# EAGLE design V1b (EAGLE 6.5.0)
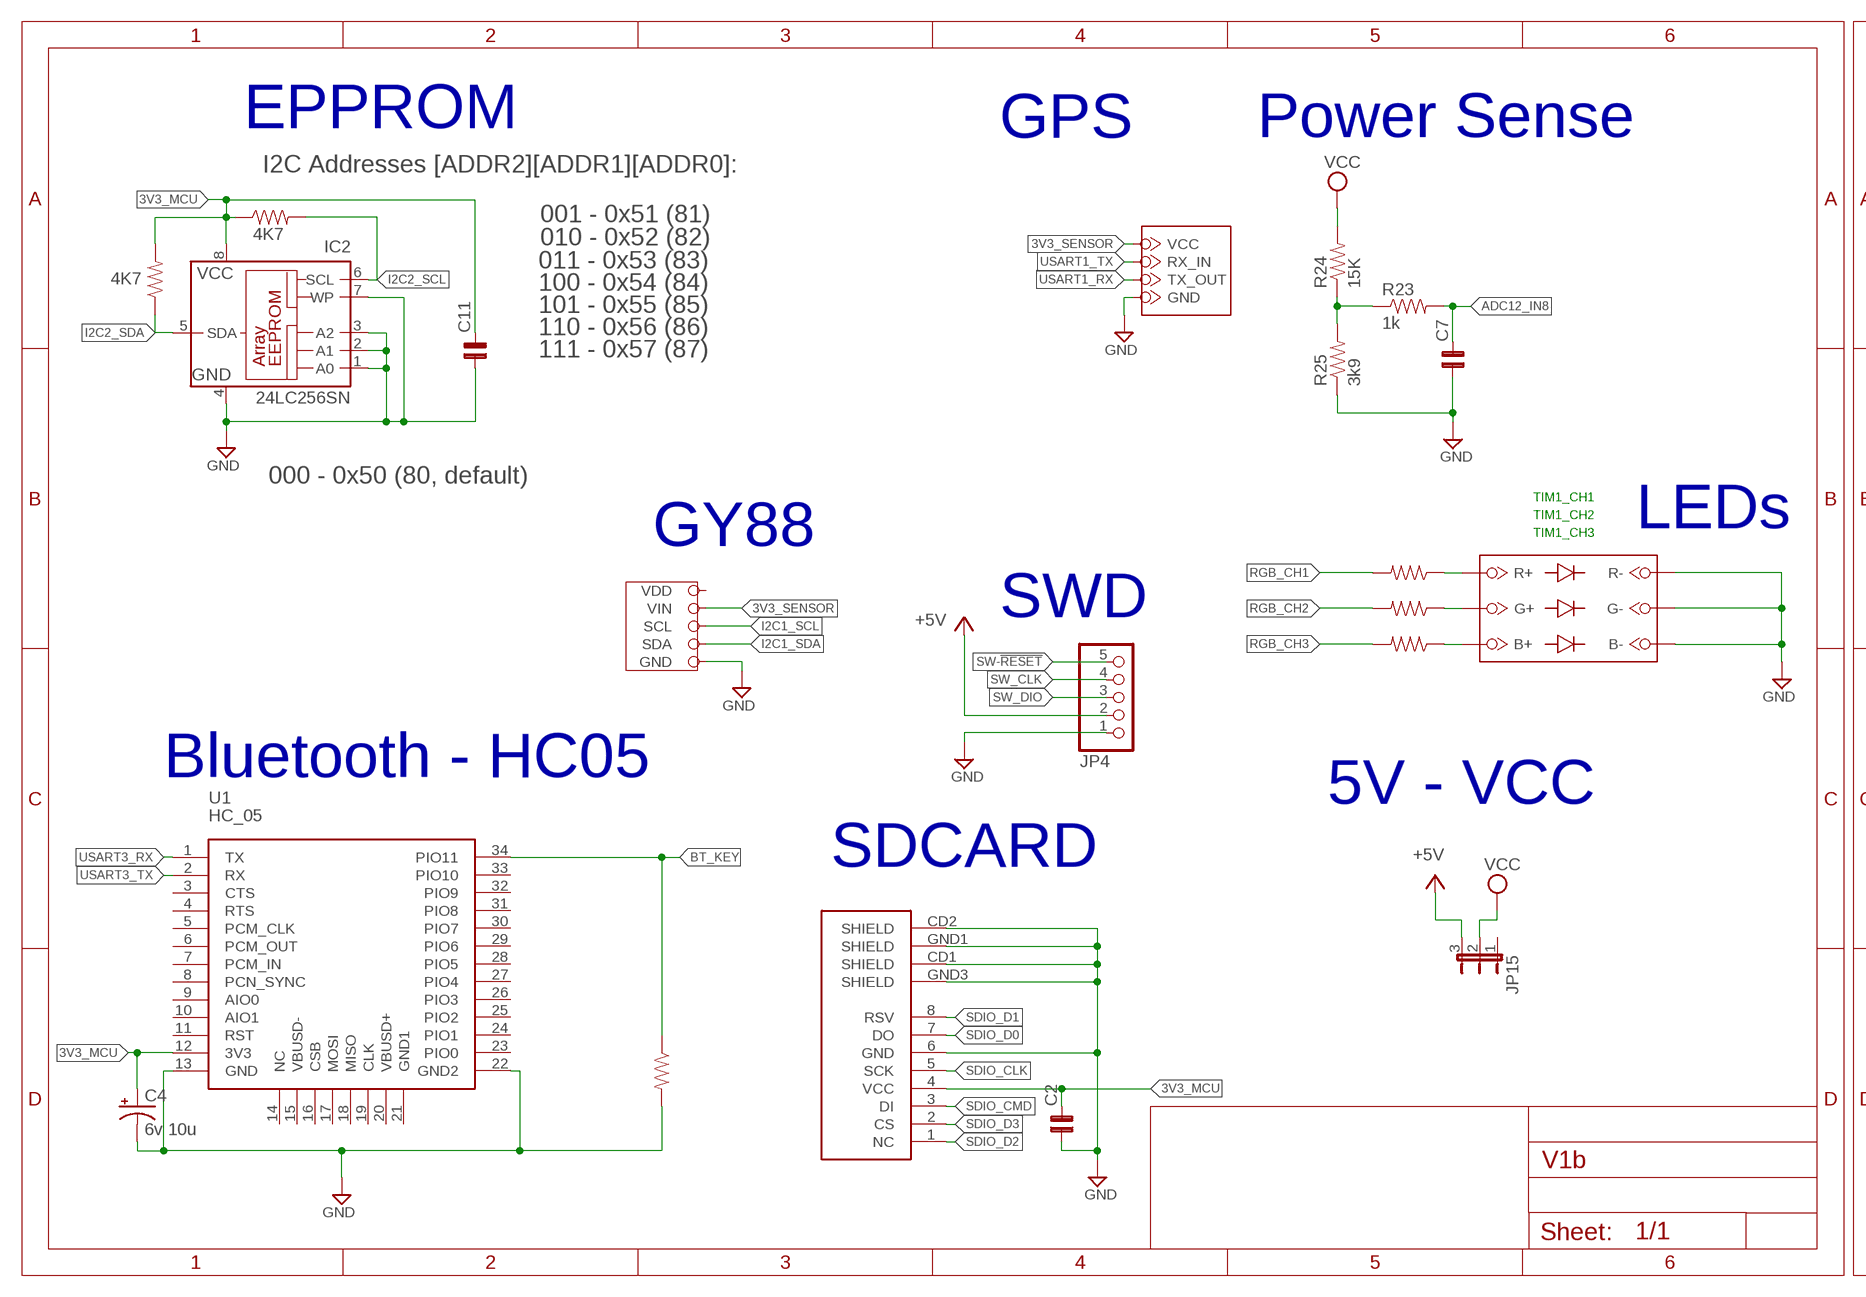
[diagram p0: schematic, sheet 1, part 1 of 2]
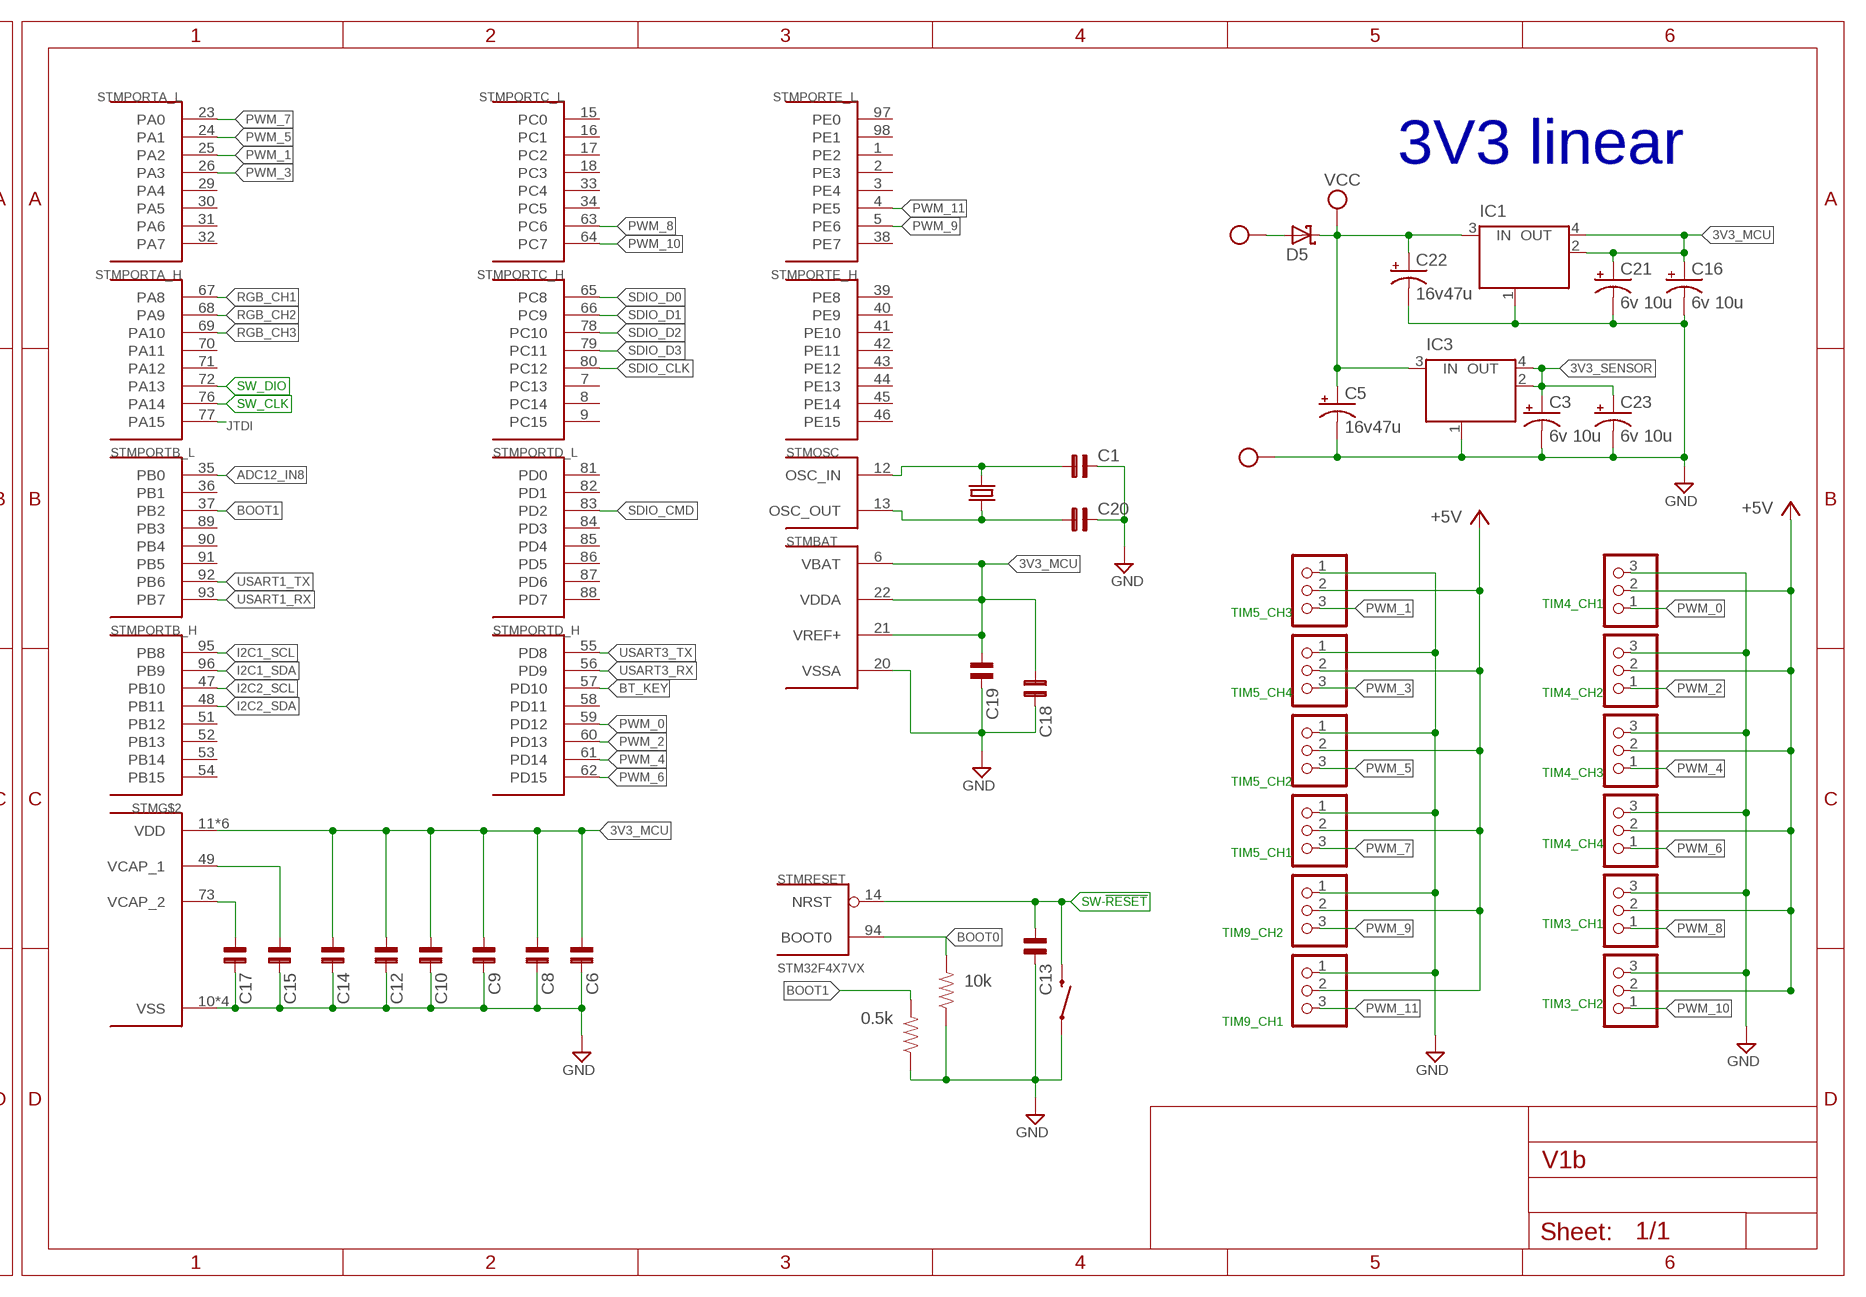
[diagram p1: schematic, sheet 1, part 2 of 2]

## Parts
C1  C-NP-SMD-0603  [C-0603]
C2  C-NP-SMD-0603  [C-0603]
C3  6v 10u  CPOL-USSMCA  [SMC_A]
C4  6v 10u  CPOL-USSMCA  [SMC_A]
C5  16v47u  CPOL-USSMCC  [SMC_C]
C6  C-NP-SMD-0603  [C-0603]
C7  C-NP-SMD-0603  [C-0603]
C8  C-NP-SMD-0603  [C-0603]
C9  C-NP-SMD-0603  [C-0603]
C10  C-NP-SMD-0603  [C-0603]
C11  C-NP-SMD-0603  [C-0603]
C12  C-NP-SMD-0603  [C-0603]
C13  C-NP-SMD-0603  [C-0603]
C14  C-NP-SMD-0603  [C-0603]
C15  C-NP-SMD-0603  [C-0603]
C16  6v 10u  CPOL-USSMCA  [SMC_A]
C17  C-NP-SMD-0603  [C-0603]
C18  C-NP-SMD-0603  [C-0603]
C19  C-NP-SMD-0603  [C-0603]
C20  C-NP-SMD-0603  [C-0603]
C21  6v 10u  CPOL-USSMCA  [SMC_A]
C22  16v47u  CPOL-USSMCC  [SMC_C]
C23  6v 10u  CPOL-USSMCA  [SMC_A]
D5  MBRS330T3  [SMC]
IC1  LINEAR_MC33269ST-3.3T3  [LINEAR_SOT223]
IC2  24LC256SN  [SO-08]
IC3  LINEAR_MC33269ST-3.3T3  [LINEAR_SOT223]
JP1  PINHD-1X3_2.54-90°  [1X03/90]
JP2  PINHD-1X3_2.54-90°  [1X03/90]
JP4  PINHD-1X5_2.54-90°  [1X05/90]
JP5  PINHD-1X3_2.54-90°  [1X03/90]
JP6  PINHD-1X3_2.54-90°  [1X03/90]
JP7  PINHD-1X3_2.54-90°  [1X03/90]
JP8  PINHD-1X3_2.54-90°  [1X03/90]
JP9  PINHD-1X3_2.54-90°  [1X03/90]
JP10  PINHD-1X3_2.54-90°  [1X03/90]
JP11  PINHD-1X3_2.54-90°  [1X03/90]
JP12  PINHD-1X3_2.54-90°  [1X03/90]
JP13  PINHD-1X3_2.54-90°  [1X03/90]
JP14  PINHD-1X3_2.54-90°  [1X03/90]
JP15  JP2E  [JP2]
R2  10K  SPARKFUN_RESISTOR0603-RES  [SPARKFUN_0603-RES]
R3  10K  SPARKFUN_RESISTOR0603-RES  [SPARKFUN_0603-RES]
R5  10K  SPARKFUN_RESISTOR0603-RES  [SPARKFUN_0603-RES]
R6  10K  SPARKFUN_RESISTOR0603-RES  [SPARKFUN_0603-RES]
R7  10k  SPARKFUN_RESISTOR0603-RES  [SPARKFUN_0603-RES]
R8  0.5k  SPARKFUN_RESISTOR0603-RES  [SPARKFUN_0603-RES]
R15  4K7  SPARKFUN_RESISTOR0603-RES  [SPARKFUN_0603-RES]
R16  4K7  SPARKFUN_RESISTOR0603-RES  [SPARKFUN_0603-RES]
R23  1k  SPARKFUN_RESISTOR0603-RES  [SPARKFUN_0603-RES]
R24  15K  SPARKFUN_RESISTOR0603-RES  [SPARKFUN_0603-RES]
R25  3k9  SPARKFUN_RESISTOR0603-RES  [SPARKFUN_0603-RES]
S1  RESET  SWITCH-MOMENTARY-2-SMD-1101NE  [TACTILE-SWITCH-1101NE]
SDCARD2  microSD Socket  USD-SOCKETNEW  [MICRO-SD-SOCKET-PP]
STM  STM32F4X7VX  [TQFP100]
U1  HC_05  [BLUETOOTH_SMD]
U$1  GY-88  [BREAKOUT]
U$8  RGB_LED  [SMD]
U$10  GPS_MODULE  [23X30]
X1  MKDSN1,5/2-5,08  [MKDSN1,5/2-5,08]
Y1  CRYSTALHC49US  [HC49US]

## Nets
3V3_MCU: C2.2 C4.+ C6.1 C8.1 C9.1 C10.1 C11.2 C12.1 C14.1 C16.+ C18.1 C19.1 C21.+ IC1.2(OUT) IC1.4(OUT) IC2.8(VCC) R15.1 R16.2 SDCARD2.4(VCC) STM.6(BAT:VBAT) STM.11(VDD) STM.19(VDD) STM.21(BAT:VREF+) STM.22(BAT:VDDA) STM.28(VDD) STM.50(VDD) STM.75(VDD) STM.100(VDD) U1.12(3V3)
3V3_SENSOR: C3.+ C23.+ IC3.2(OUT) IC3.4(OUT) U$1.2(VIN) U$10.4(VCC)
+5V: JP1.2 JP2.2 JP4.2 JP5.2 JP6.2 JP7.2 JP8.2 JP9.2 JP10.2 JP11.2 JP12.2 JP13.2 JP14.2 JP15.3
ADC12_IN8: C7.2 R23.2 STM.35(PORTB_L:PB0)
BOOT0: R7.2 STM.94(RESET:BOOT0)
BOOT1: R8.2 STM.37(PORTB_L:PB2)
BT_KEY: R5.1 STM.57(PORTD_H:PD10) U1.34(PIO11)
GND: C1.2 C2.1 C3.- C4.- C5.- C6.2 C7.1 C8.2 C9.2 C10.2 C11.1 C12.2 C13.2 C14.2 C15.2 C16.- C17.2 C18.2 C19.2 C20.2 C21.- C22.- C23.- IC1.1(GND/ADJ) IC2.1(A0) IC2.2(A1) IC2.3(A2) IC2.4(GND) IC2.7(WP) IC3.1(GND/ADJ) JP1.1 JP2.1 JP4.1 JP5.1 JP6.1 JP7.3 JP8.1 JP9.3 JP10.3 JP11.1 JP12.3 JP13.3 JP14.3 R5.2 R7.1 R8.1 R25.1 S1.P$1 SDCARD2.6(GND) SDCARD2.CD1(SHIELD) SDCARD2.CD2(SHIELD) SDCARD2.GND1(SHIELD) SDCARD2.GND3(SHIELD) STM.10(VSS) STM.20(BAT:VSSA) STM.27(VSS) STM.74(VSS) STM.99(VSS) U1.13(GND) U1.22(GND2) U$1.3(GND) U$8.B- U$8.G- U$8.R- U$10.1(GND) X1.2
I2C1_SCL: STM.95(PORTB_H:PB8) U$1.4(SCL)
I2C1_SDA: STM.96(PORTB_H:PB9) U$1.5(SDA)
I2C2_SCL: IC2.6(SCL) R15.2 STM.47(PORTB_H:PB10)
I2C2_SDA: IC2.5(SDA) R16.1 STM.48(PORTB_H:PB11)
JTDI: STM.77(PORTA_H:PA15)
N$1: C1.1 STM.12(OSC:OSC_IN) Y1.2
N$2: D5.A X1.1
N$7: R2.1 U$8.B+
N$9: R3.1 U$8.G+
N$10: R6.1 U$8.R+
N$27: R23.1 R24.1 R25.2
N$29: C20.1 STM.13(OSC:OSC_OUT) Y1.1
N$31: C17.1 STM.73(VCAP_2)
N$32: C15.1 STM.49(VCAP_1)
PWM_0: JP7.1 STM.59(PORTD_H:PD12)
PWM_1: JP11.3 STM.25(PORTA_L:PA2)
PWM_2: JP9.1 STM.60(PORTD_H:PD13)
PWM_3: JP6.3 STM.26(PORTA_L:PA3)
PWM_4: JP10.1 STM.61(PORTD_H:PD14)
PWM_5: JP5.3 STM.24(PORTA_L:PA1)
PWM_6: JP12.1 STM.62(PORTD_H:PD15)
PWM_7: JP1.3 STM.23(PORTA_L:PA0)
PWM_8: JP13.1 STM.63(PORTC_L:PC6)
PWM_9: JP8.3 STM.5(PORTE_L:PE6)
PWM_10: JP14.1 STM.64(PORTC_L:PC7)
PWM_11: JP2.3 STM.4(PORTE_L:PE5)
RGB_CH1: R6.2 STM.67(PORTA_H:PA8)
RGB_CH2: R3.2 STM.68(PORTA_H:PA9)
RGB_CH3: R2.2 STM.69(PORTA_H:PA10)
SDIO_CLK: SDCARD2.5(SCK) STM.80(PORTC_H:PC12)
SDIO_CMD: SDCARD2.3(DI) STM.83(PORTD_L:PD2)
SDIO_D0: SDCARD2.7(DO) STM.65(PORTC_H:PC8)
SDIO_D1: SDCARD2.8(RSV) STM.66(PORTC_H:PC9)
SDIO_D2: SDCARD2.1(NC) STM.78(PORTC_H:PC10)
SDIO_D3: SDCARD2.2(CS) STM.79(PORTC_H:PC11)
SW-!RESET: C13.1 JP4.5 S1.P$2 STM.14(RESET:NRST)
SW_CLK: JP4.4 STM.76(PORTA_H:PA14)
SW_DIO: JP4.3 STM.72(PORTA_H:PA13)
USART1_RX: STM.93(PORTB_L:PB7) U$10.2(TX_OUT)
USART1_TX: STM.92(PORTB_L:PB6) U$10.3(RX_IN)
USART3_RX: STM.56(PORTD_H:PD9) U1.1(TX)
USART3_TX: STM.55(PORTD_H:PD8) U1.2(RX)
VCC: C5.+ C22.+ D5.C IC1.3(IN) IC3.3(IN) JP15.2 R24.2
Unconnected: JP15.1 STM.1(PORTE_L:PE2) STM.2(PORTE_L:PE3) STM.3(PORTE_L:PE4) STM.7(PORTC_H:PC13) STM.8(PORTC_H:PC14) STM.9(PORTC_H:PC15) STM.15(PORTC_L:PC0) STM.16(PORTC_L:PC1) STM.17(PORTC_L:PC2) STM.18(PORTC_L:PC3) STM.29(PORTA_L:PA4) STM.30(PORTA_L:PA5) STM.31(PORTA_L:PA6) STM.32(PORTA_L:PA7) STM.33(PORTC_L:PC4) STM.34(PORTC_L:PC5) STM.36(PORTB_L:PB1) STM.38(PORTE_L:PE7) STM.39(PORTE_H:PE8) STM.40(PORTE_H:PE9) STM.41(PORTE_H:PE10) STM.42(PORTE_H:PE11) STM.43(PORTE_H:PE12) STM.44(PORTE_H:PE13) STM.45(PORTE_H:PE14) STM.46(PORTE_H:PE15) STM.51(PORTB_H:PB12) STM.52(PORTB_H:PB13) STM.53(PORTB_H:PB14) STM.54(PORTB_H:PB15) STM.58(PORTD_H:PD11) STM.70(PORTA_H:PA11) STM.71(PORTA_H:PA12) STM.81(PORTD_L:PD0) STM.82(PORTD_L:PD1) STM.84(PORTD_L:PD3) STM.85(PORTD_L:PD4) STM.86(PORTD_L:PD5) STM.87(PORTD_L:PD6) STM.88(PORTD_L:PD7) STM.89(PORTB_L:PB3) STM.90(PORTB_L:PB4) STM.91(PORTB_L:PB5) STM.97(PORTE_L:PE0) STM.98(PORTE_L:PE1) U1.3(CTS) U1.4(RTS) U1.5(PCM_CLK) U1.6(PCM_OUT) U1.7(PCM_IN) U1.8(PCN_SYNC) U1.9(AIO0) U1.10(AIO1) U1.11(RST) U1.14(NC) U1.15(VBUSD-) U1.16(CSB) U1.17(MOSI) U1.18(MISO) U1.19(CLK) U1.20(VBUSD+) U1.21(GND1) U1.23(PIO0) U1.24(PIO1) U1.25(PIO2) U1.26(PIO3) U1.27(PIO4) U1.28(PIO5) U1.29(PIO6) U1.30(PIO7) U1.31(PIO8) U1.32(PIO9) U1.33(PIO10) U$1.1(VDD)

## Notes on the sheet
- GPS
- EPPROM | Power Sense
- 3V3 linear
- I2C Addresses [ADDR2][ADDR1][ADDR0]:
- 001 - 0x51 (81)
- 010 - 0x52 (82)
- 011 - 0x53 (83)
- 100 - 0x54 (84)
- 101 - 0x55 (85)
- 110 - 0x56 (86)
- 111 - 0x57 (87)
- 000 - 0x50 (80, default)
- TIM1_CH1
- TIM1_CH2
- LEDs
- TIM1_CH3
- GY88
- TIM4_CH1
- SWD | TIM5_CH3
- TIM5_CH4 | TIM4_CH2
- Bluetooth - HC05 | TIM4_CH3
- TIM5_CH2
- SDCARD | 5V - VCC
- TIM4_CH4
- TIM5_CH1
- TIM3_CH1
- TIM9_CH2
- TIM3_CH2
- TIM9_CH1
- TJA1040

## Library data of the parts
C1 C2 C6-C15 C17-C20 = cap-pan40:C-NP: NON-POLARIZED FILM/CHIP
C3-C5 C16 C21-C23 = rcl:CPOL-US: POLARIZED CAPACITOR, American symbol
D5 = Robotech Diode of Chung:MBRS3*0T3: SCHOTTKY BARRIER RECTIFIER 3.0 AMPERES 20, 30, 40 VOLT Source: MBRS340T3-D.pdf
IC1 IC3 = Robotech_Other:LINEAR_MC33269ST*: Adjustable Output Low Dropout Voltage Regulator 800 mA Source: http://www.onsemi.com/pub/Collateral/MC33269-D.PDF
IC2 = microchip:24*: Serial EEPROM I2C; DIGIKEY: 24LC256-E/SN-ND; MF: MICROCHIP; MPN: 24LC256-I/SN; OC_FARNELL: 9757996; OC_NEWARK: 27C9144
JP1 JP2 JP5-JP14 = pinhead-1:PINHD-1X3: PIN HEADER
JP4 = pinhead-1:PINHD-1X5: PIN HEADER
JP15 = jumper:JP2E: JUMPER
R2 R3 R5-R8 R15 R16 R23-R25 = Robotech_RCL:SPARKFUN_RESISTOR: Resistor Basic schematic elements and footprints for 0603, 1206, and PTH resistors.
S1 = pixhawk2:SWITCH-MOMENTARY-2; PARTNO: EVQ-P7J01P
SDCARD2 = SparkFun:USD-SOCKET: microSD Socket Push-push type uSD socket. Schematic element and footprint production proven. Spark Fun Electronics SKU : PRT-00127. tDoc lines correctly indicate media card edge positions when inserting (unlocked, locked, depressed).
STM = pixhawk2:STM32F4X7VX: STM32F4X7VX 100 pin LQFP STM32F407VE - 512 KB flash, no crypto STM32F407VG - 1 MB flash, no crypto STM32F417VE - 512 KB flash, with crypto STM32F417VG - 1 MB flash, with crypto; PARTNO: STM32F427VI
U1 = SerialPortBluetooth:HC_05
U$1 = GY88:GY-88
U$8 = RGB_LED:RGB_LED
U$10 = GPS_module:GPS_MODULE
X1 = con-phoenix-508:MKDSN1,5/2-5,08: MKDSN 1,5/ 2-5,08 Printklemme Nennstrom: 13,5 A Nennspannung: 250 V Rastermaß: 5,08 mm Polzahl: 2 Anschlussart: Schraubanschluss Montage: Löten Anschlussrichtung Leiter/Platine: 0 ° Artikelnummer: 1729128 Source: http://eshop.phoenixcontact.com .. 1729128.pdf; MPN: MKDSN 1,5/2-5.08; OC_FARNELL: 1792903; OC_NEWARK: 30M2397
Y1 = SparkFun-FreqCtrl:CRYSTAL: Various standard crystals. Proven footprints. Spark Fun Electronics SKU : COM-00534

## Net classes
0 Default: width 0.203 mm
1 power: width 0.15 mm, drill 0.2 mm, clearance 0.152 mm

## Board
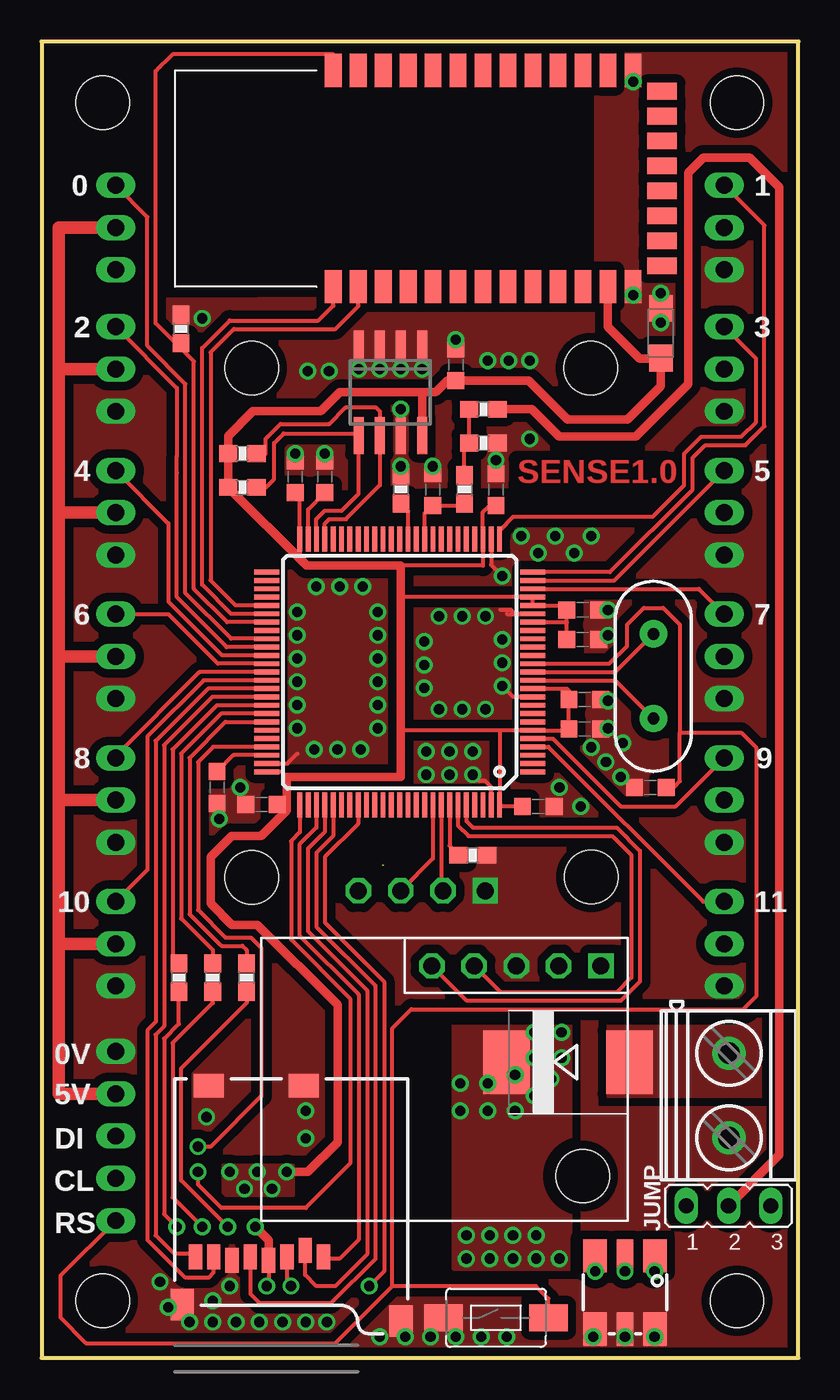
[diagram p2: board, top side]
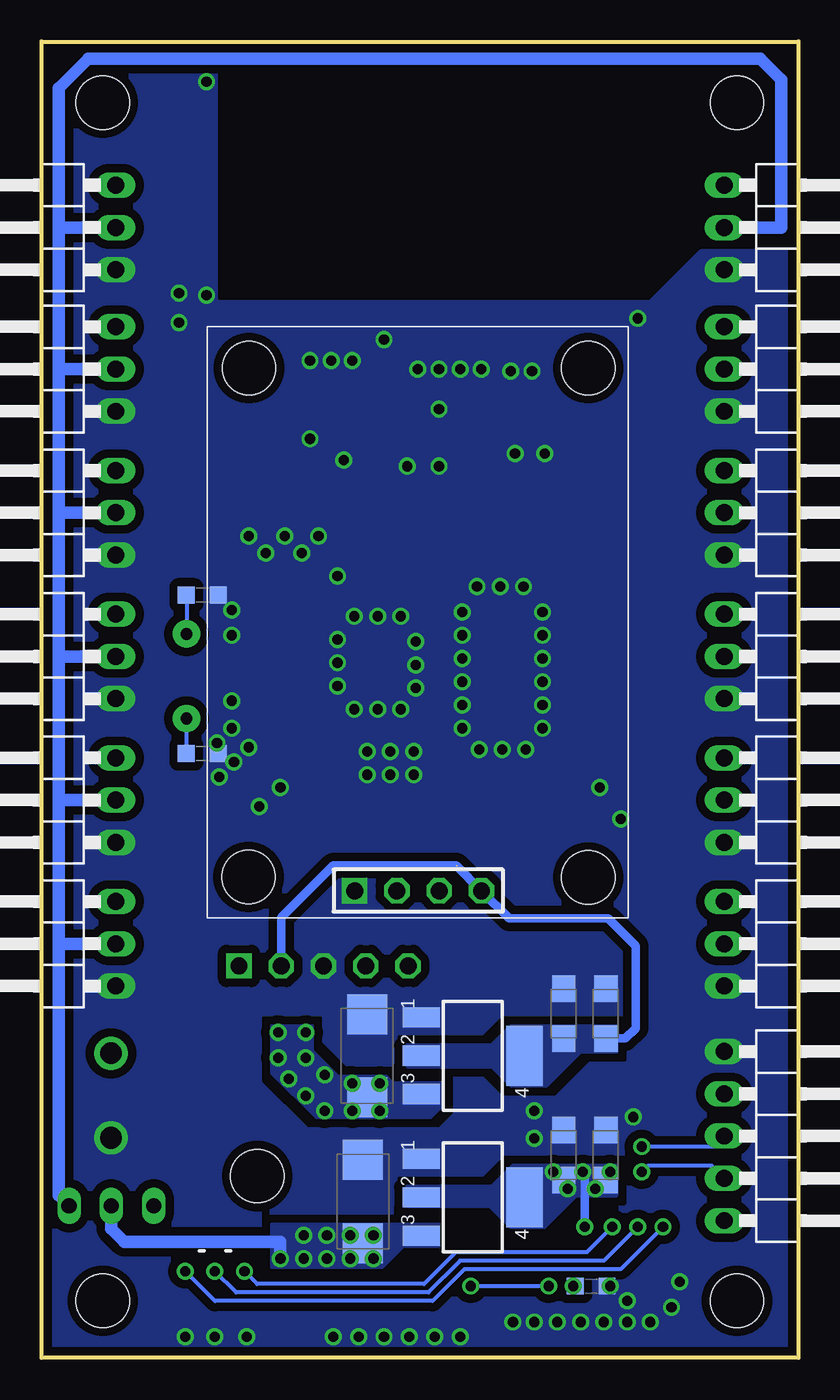
[diagram p3: board, bottom side, seen from below]

Size 45.47 x 79.12 mm. Coordinates in mm from the lower left corner, seen from the top.
Outline: 45.47,79.12 0,79.12 0,0 45.47,0 45.47,79.12
Copper layers (1*16): Top 0.035mm / dielectric 1.5mm / Bottom 0.035mm
Design rules "default *": minimum track width 10mil, minimum drill 24mil, track to track 8mil, track to pad 8mil, pad to pad 8mil, via to via 10mil, smd to smd 8mil, copper to edge 20mil, drill to drill 10mil, minimum pad ring 10mil, minimum via ring 8mil, stop-mask expansion 0mil, vias tented up to drill 100mil, thermal gap 10mil
Holes 3.2 mm at 41.78,75.44 3.68,75.44 41.78,3.43 3.68,3.43

### Footprints (pad centres in the part's own frame; a part is rotated, then mirrored left to right if it is on the bottom)
C-0603 = smd 1.016 x 1.016: 1 -0.953,0; 2 0.953,0
SMC_A = smd 1.6 x 1.4: + -1.5,0; - 1.5,0
SMC_C = smd 2.4 x 2.4: + -2.5,0; - 2.5,0
SMC = smd 2.8 x 3.8: A 3.7,0; C -3.7,0
LINEAR_SOT223 = smd 1.219 x 2.235: 1 -2.311,-3.099; 2 0,-3.099; 3 2.311,-3.099 | smd 3.6 x 2.2: 4 0,3.099
SO-08 = smd 0.6 x 2.2: 1 -1.905,-2.6; 2 -0.635,-2.6; 3 0.635,-2.6; 4 1.905,-2.6; 5 1.905,2.6; 6 0.635,2.6; 7 -0.635,2.6; 8 -1.905,2.6
1X03/90 = drill 1.016 long: 1 -2.54,-3.81; 2 0,-3.81; 3 2.54,-3.81
1X05/90 = drill 1.016 long: 1 -5.08,-3.81; 2 -2.54,-3.81; 3 0,-3.81; 4 2.54,-3.81; 5 5.08,-3.81
JP2 = drill 0.914 long: 1 -2.54,0; 2 0,0; 3 2.54,0
SPARKFUN_0603-RES = smd 1.1 x 1: 1 -0.85,0; 2 0.85,0
TACTILE-SWITCH-1101NE = smd 2.3 x 1.6: P$1 -3.15,0; P$2 3.15,0
MICRO-SD-SOCKET-PP = smd 0.8 x 1.5: 1 -8.94,10.7; 2 -7.84,10.3; 3 -6.74,10.7; 4 -5.64,10.9; 5 -4.54,10.7; 6 -3.44,10.9; 7 -2.34,10.7; 8 -1.24,10.7 | smd 1.8 x 1.4: CD1 -2.05,0.4; CD2 -7.75,0.4 | smd 1.4 x 1.9: GND1 -13.6,14.55; GND3 -0.45,13.55
TQFP100 = smd 1.5 x 0.29: 1 -8,6; 2 -8,5.5; 3 -8,5; 4 -8,4.5; 5 -8,4; 6 -8,3.5; 7 -8,3; 8 -8,2.5; 9 -8,2; 10 -8,1.5; 11 -8,1; 12 -8,0.5; 13 -8,0; 14 -8,-0.5; 15 -8,-1; 16 -8,-1.5; 17 -8,-2; 18 -8,-2.5; 19 -8,-3; 20 -8,-3.5; 21 -8,-4; 22 -8,-4.5; 23 -8,-5; 24 -8,-5.5; 25 -8,-6; 51 8,-6; 52 8,-5.5; 53 8,-5; 54 8,-4.5; 55 8,-4; 56 8,-3.5; 57 8,-3; 58 8,-2.5; 59 8,-2; 60 8,-1.5; 61 8,-1; 62 8,-0.5; 63 8,0; 64 8,0.5; 65 8,1; 66 8,1.5; 67 8,2; 68 8,2.5; 69 8,3; 70 8,3.5; 71 8,4; 72 8,4.5; 73 8,5; 74 8,5.5; 75 8,6 | smd 0.29 x 1.5: 26 -6,-8; 27 -5.5,-8; 28 -5,-8; 29 -4.5,-8; 30 -4,-8; 31 -3.5,-8; 32 -3,-8; 33 -2.5,-8; 34 -2,-8; 35 -1.5,-8; 36 -1,-8; 37 -0.5,-8; 38 0,-8; 39 0.5,-8; 40 1,-8; 41 1.5,-8; 42 2,-8; 43 2.5,-8; 44 3,-8; 45 3.5,-8; 46 4,-8; 47 4.5,-8; 48 5,-8; 49 5.5,-8; 50 6,-8; 76 6,8; 77 5.5,8; 78 5,8; 79 4.5,8; 80 4,8; 81 3.5,8; 82 3,8; 83 2.5,8; 84 2,8; 85 1.5,8; 86 1,8; 87 0.5,8; 88 0,8; 89 -0.5,8; 90 -1,8; 91 -1.5,8; 92 -2,8; 93 -2.5,8; 94 -3,8; 95 -3.5,8; 96 -4,8; 97 -4.5,8; 98 -5,8; 99 -5.5,8; 100 -6,8
BLUETOOTH_SMD = smd 2 x 1: 1 0,0; 2 0,-1.5; 3 0,-3; 4 0,-4.5; 5 0,-6; 6 0,-7.5; 7 0,-9; 8 0,-10.5; 9 0,-12; 10 0,-13.5; 11 0,-15; 12 0,-16.5; 13 0,-18; 22 13,-18; 23 13,-16.5; 24 13,-15; 25 13,-13.5; 26 13,-12; 27 13,-10.5; 28 13,-9; 29 13,-7.5; 30 13,-6; 31 13,-4.5; 32 13,-3; 33 13,-1.5; 34 13,0 | smd 1 x 1.8: 14 1.25,-19.75; 15 2.75,-19.75; 16 4.25,-19.75; 17 5.75,-19.75; 18 7.25,-19.75; 19 8.75,-19.75; 20 10.25,-19.75; 21 11.75,-19.75
BREAKOUT = drill 1.016 square: 1 12.64,-1.096 | drill 1.016 octagon: 2 12.64,1.444; 3 12.64,3.984; 4 12.64,6.524; 5 12.64,9.064 | hole 3.2: 0.006,0
SMD = smd 1.99 x 1.4: B+ -2.2,-1.8; B- 2.2,-1.8; R+ -2.2,1.8; R- 2.2,1.8 | smd 1.99 x 1: G+ -2.2,0; G- 2.2,0
23X30 = drill 1.016 square: 1 0.013,-6.237 | drill 1.016 octagon: 2 0.013,-8.777; 3 0.013,-11.317; 4 0.013,-13.857 | hole 3.2: 31.429,-20.267; 31.429,0.113; 0.811,-20.263; 0.837,0.139
MKDSN1,5/2-5,08 = drill 1.3 pad 2: 1 -2.561,0.025; 2 2.519,0.025
HC49US = drill 0.7 pad 1.651: 1 -2.54,0; 2 2.54,0

### Placement (x,y rotation side)
C1  35.81,36.32 0 bottom
C2  12.45,4.32 180 bottom
C3  14.1,20.7 90 bottom
C4  37.21,61.59 90 top
C5  25.91,18.16 90 bottom
C6  32.51,44.96 0 top
C7  23.5,52.2 270 top
C8  32.51,43.18 0 top
C9  32.64,39.57 0 top
C10  32.64,37.8 0 top
C11  24.89,59.69 270 top
C12  29.85,33.15 0 top
C13  36.58,34.29 180 top
C14  27.3,52.2 90 top
C15  17.02,52.96 90 top
C16  14.1,12.19 90 bottom
C17  10.54,34.29 270 top
C18  15.24,52.96 90 top
C19  13.21,33.27 180 top
C20  35.81,45.85 0 bottom
C21  11.56,12.19 90 bottom
C22  26.16,9.4 90 bottom
C23  11.56,20.7 90 bottom
D5  31.62,17.78 0 top
IC1  19.56,9.65 270 bottom
IC2  20.96,58.04 180 top
IC3  19.56,18.16 270 bottom
JP1  44.83,42.16 90 bottom
JP2  44.83,24.89 90 bottom
JP4  0.64,13.33 270 bottom
JP5  44.83,50.8 90 bottom
JP6  44.83,59.44 90 bottom
JP7  0.64,67.95 270 bottom
JP8  44.83,33.53 90 bottom
JP9  0.64,59.44 270 bottom
JP10  0.64,50.8 270 bottom
JP11  44.83,67.95 90 bottom
JP12  0.64,42.16 270 bottom
JP13  0.64,33.53 270 bottom
JP14  0.64,24.89 270 bottom
JP15  41.27,9.14 0 top
R2  12.32,22.86 90 top
R3  10.29,22.86 90 top
R5  8.38,61.85 90 top
R6  8.25,22.86 90 top
R7  25.91,30.23 180 top
R8  21.59,52.2 270 top
R15  12.06,54.36 0 top
R16  12.06,52.32 180 top
R23  25.4,52.2 270 top
R24  26.54,57.02 0 top
R25  26.54,54.99 180 top
S1  27.3,2.41 0 top
SDCARD2  8,16.76 180 top
STM  21.52,41.23 180 top
U1  17.53,64.39 90 top
U$1  32.51,10.92 90 top
U$8  35.05,3.94 270 top
U$10  32.89,28.07 90 bottom
X1  41.27,15.75 270 top
Y1  36.76,40.97 270 top

### Tracks (layer width: path | path; a pad name or v marks a point on that pad's centre or on a via)
3V3_MCU  (via drill 0.61)
  Top 0.254: STM.6 21.59,37.72 21.59,38.1 | C8.1 31.56,44.23 | STM.19 31.56,44.23 | 31.56,44.23 C6.1 31.29,45.23 STM.21 STM.22 21.59,45.73 | STM.6 31.56,37.73 31.69,37.85 | C10.1 31.69,37.85 | 31.69,37.85 C9.1 31.69,40.1 31.56,40.23 STM.11 | STM.100 27.56,33.27 | 13.46,35.23 STM.75 14.43,35.23 14.73,34.92 | 28.7,33.15 27.52,33.15 STM.100 | 28.83,33.08 C12.1 | 15.83,47.71 15.52,48.02 STM.50 15.52,51.73 C18.1 | 13.64,9.96 v13.84,10.16 | C14.1 26.93,51.24 26.52,50.83 STM.28 26.52,47.62 21.59,47.62 | SDCARD2.4 13.64,4.43 v13.52,4.32 | 21.59,37.73 21.59,37.46 | STM.6 27.52,37.73 STM.100
  Top 0.508: 28.7,33.15 C12.1 | IC2.8 22.86,57.91 | 22.86,57.91 22.86,58.04 23.69,58.04 24.38,58.74 C11.2 29.27,58.74 31.62,56.39 35.18,56.39 37.21,58.42 C4.+ 37.19,60.07 35.94,60.07 34.03,61.99 U1.12 | SDCARD2.4 13.64,7.06 v12.83,7.87 | v14.73,11.18 16,11.18 17.78,12.95 17.78,21.21 12.95,26.04 11.43,26.04 10.16,27.3 10.16,30.1 11.43,31.37 13.21,31.37 14.73,32.89 14.73,33.27 | v14.73,11.18 14.6,11.18 14.48,11.05 14.6,11.05 v14.73,11.18 | 14.73,33.27 14.73,34.92 21.59,34.92 21.59,37.46 21.59,38.1 21.59,45.73 21.59,47.62 15.91,47.62 15.83,47.71 R16.2 R15.1 11.21,55.41 12.7,56.9 16.76,56.9 17.91,58.04 22.73,58.04 22.86,57.91 | 14.73,33.27 C19.1
  Bottom 0.254: v13.52,4.32 C2.2
  Bottom 0.508: v12.83,7.87 12.83,11.05 v12.95,11.18
  other vias: 11.3,11.18 12.19,10.16
  pour Bottom (isolate 0.508, no thermals): 18.42,10.29 23.5,10.29 23.5,9.14 18.54,9.14 17.27,7.87 15.24,7.87 13.33,9.78 10.92,9.78 10.92,11.56 17.14,11.56
  pour Top (isolate 0.508, rank 3, no thermals): 10.92,9.78 15.11,9.78 15.11,11.56 10.92,11.56
3V3_SENSOR  (1 unrouted)
  Bottom 0.508: U$1.2 31.07,26.46 27.94,29.59 20.55,29.59 U$10.4 17.37,26.42 11.43,26.42 9.78,24.77 9.78,19.81 10.39,19.2 C23.+
  pour Bottom (isolate 0.508, no thermals): 23.5,17.53 18.42,17.53 17.27,16.38 15.11,16.38 13.08,18.42 10.92,18.42 10.92,19.94 17.27,19.94 18.42,18.8 23.5,18.8
+5V
  Top 0.762: 1.02,59.44 1.02,67.95 JP7.2 | 1.02,59.44 1.02,50.8 | 1.02,50.8 1.02,42.16 | 1.02,42.16 1.02,33.53 | 1.02,33.53 1.02,24.89 | 1.02,24.89 1.02,15.87 JP4.2 | JP9.2 1.02,59.44 | JP10.2 1.02,50.8 | JP12.2 1.02,42.16 | JP13.2 1.02,33.53 | JP14.2 1.02,24.89
  Bottom 0.762: JP2.2 44.45,24.89 | 44.45,24.89 44.45,33.53 | 44.45,33.53 44.45,42.16 | 44.45,42.16 44.45,50.8 | 44.45,59.44 44.45,50.8 | JP5.2 44.45,50.8 | JP1.2 44.45,42.16 | JP8.2 44.45,33.53 | JP6.2 44.45,59.44 | JP11.2 44.45,67.95 | 44.45,67.95 44.45,59.44 | 44.45,67.95 44.45,76.33 42.67,78.11 2.29,78.11 1.02,76.84 1.02,67.95 JP7.2 2.92,67.95 | 44.45,24.89 44.45,9.78 JP15.3
ADC12_IN8
  Top 0.254: 23.27,51.02 C7.2 | STM.35 23.02,50.77 C7.2 | C7.2 25.4,51.24 R23.2
BOOT0
  Top 0.254: STM.94 24.51,30.77 R7.2
BOOT1
  Top 0.254: STM.37 22.02,50.92 R8.2
BT_KEY
  Top 0.254: STM.57 11.14,44.23 9.14,46.23 9.14,59.9 8.22,60.83 | 17.48,77.34 U1.34 17.53,78.36 7.87,78.36 7.56,78.04 7.11,77.6 6.86,77.34 6.86,62.19 8.22,60.83 | R5.1 8.22,60.83
GND  (via drill 0.61)
  Top 0.254: 27.56,44.96 28.19,44.96 28.43,44.73 STM.20 27.96,44.73 | STM.27 27.02,47.66 v27.69,46.99 | STM.74 14.77,35.73 15.37,36.32 | STM.99 27.02,34.32 26.67,34.67 26.29,34.67 v25.91,35.05 | SDCARD2.6 11.34,5.97 11.3,5.97 | STM.10 28.35,39.73 v27.69,40.39
  other vias: 17.02,54.36 28.83,49.4 30.86,49.4 21.59,53.59 22.99,43.05 22.99,41.66 22.99,40.26 23.88,38.99 25.27,38.99 26.67,38.99 27.69,43.18 27.69,41.78 23.88,44.58 25.27,44.58 26.67,44.58 10.67,32.38 20.19,39.24 20.19,40.64 20.19,42.04 20.19,37.85 16.51,46.35 19.3,46.35 17.91,46.35 16.38,36.58 19.18,36.58 17.78,36.58 20.19,43.43 20.19,44.83 15.37,44.83 15.37,43.43 15.37,39.24 15.37,40.64 15.37,42.04 15.37,37.85 23.11,36.45 25.91,36.45 24.51,36.45 23.11,35.05 24.51,35.05 29.85,48.39 23.5,53.59 22.86,59.44 21.59,59.44 20.32,59.44 19.05,59.44 37.21,62.23 15.24,54.36 11.3,4.32 15.87,14.86 9.91,14.48 7.11,4.57 7.62,3.05 8.89,2.16 10.29,2.16 11.68,2.16 13.08,2.16 14.48,2.16 15.87,2.16 17.14,2.16 10.29,3.43 20.32,1.27 21.84,1.27 23.37,1.27 24.89,1.27 26.42,1.27 27.94,1.27 33.15,1.27 35.05,1.27 36.83,1.27 9.65,62.48 11.94,34.29 15.87,13.21 32.38,33.15 31.12,34.29 34.04,44.96 34.04,43.43 34.04,39.5 34.04,37.85 34.92,36.96 33.02,36.7 33.91,35.81 34.8,34.92 21.59,57.02 29.34,55.24 27.3,53.97 37.21,64.01 35.56,76.71 17.27,59.31 16,59.31 24.89,61.21 29.34,59.94 28.07,59.94 26.8,59.94 32,48.39 33.02,49.4 35.56,63.88
  pour Top (isolate 0.508, rank 6, no thermals): -0.64,63.5 -1.65,63.5 -1.65,-0.64 56.64,-0.64 56.64,80.26 33.4,80.26 33.4,63.63
  pour Bottom (isolate 0.508, rank 6, no thermals): -1.91,66.42 5.84,66.42 8.89,63.37 35.05,63.37 35.05,81.03 50.67,81.03 50.55,-2.41 -1.91,-2.41
I2C1_SCL
  Top 0.254: STM.95 25.02,32.01 25.65,31.37 34.29,31.37 35.43,30.23 35.43,22.86 34.54,21.97 27.58,21.97 U$1.4
I2C1_SDA
  Top 0.254: STM.96 25.52,32.27 25.91,31.88 34.54,31.88 35.94,30.48 35.94,22.61 35.56,22.23 35.43,22.1 34.8,21.46 25.55,21.46 U$1.5
I2C2_SCL
  Top 0.254: STM.47 17.02,50.16 17.27,50.42 18.29,50.42 20.32,52.45 IC2.6 20.32,56.9 20.07,57.15 18.29,57.15 17.27,56.13 14.35,56.13 13.46,55.24 13.46,54.36 R15.2
I2C2_SDA
  Top 0.254: STM.48 16.52,50.43 17.02,50.93 18.03,50.93 19.05,51.94 IC2.5 18.92,55.57 14.54,55.57 13.97,54.99 13.97,52.83 13.46,52.32 R16.1
N$1
  Top 0.254: STM.12 34.46,40.73 Y1.2
  Bottom 0.254: C1.1 Y1.2
N$2
  pour Top (isolate 0.762, no thermals): 34.04,20.32 34.04,15.75 43.43,15.75 43.43,20.32
N$7  (via drill 0.61)
  Top 0.254: v33.27,5.21 33.27,6.12 U$8.B+ | v11.18,7.87 8.38,10.67 8.38,17.4 12.32,21.34 R2.1
  Bottom 0.254: v33.27,5.21 32.51,4.45 22.48,4.45 20.57,6.35 12.7,6.35 v11.18,7.87
N$9  (via drill 0.61)
  Top 0.254: v35.05,5.21 U$8.G+ | v9.65,7.87 7.87,9.65 7.87,18.92 10.29,21.34 R3.1
  Bottom 0.254: v35.05,5.21 33.78,3.94 22.23,3.94 20.32,5.84 11.68,5.84 v9.65,7.87
N$10  (via drill 0.61)
  Top 0.254: v36.83,5.21 36.83,6.12 U$8.R+ | v8.13,7.87 7.37,8.64 7.37,19.18 8.25,20.07 R6.1
  Bottom 0.254: v36.83,5.21 35.05,3.43 21.97,3.43 20.07,5.33 10.67,5.33 v8.13,7.87
N$27
  Top 0.254: R23.1 25.4,54.7 | 25.4,54.7 25.4,54.99 25.53,55.12 | R24.1 R25.2 25.4,54.7
N$29
  Top 0.254: STM.13 34.47,41.23 Y1.1
  Bottom 0.254: C20.1 Y1.1
N$31
  Top 0.254: STM.73 11.53,36.23 C17.1
N$32
  Top 0.254: STM.49 16.02,51 C15.1
PWM_0
  Top 0.254: STM.59 11.38,43.23 8.64,45.97 8.64,58.55 6.35,60.83 6.35,68.58 JP7.1
PWM_1
  Top 0.254: STM.25 34.15,47.23 39.12,52.2 39.12,54.1 39.88,54.86 42.29,54.86 43.43,56.01 43.43,68.07 JP11.3
PWM_2
  Top 0.254: STM.60 11.12,42.73 8.13,45.72 8.13,53.21 8.13,54.23 8.13,58.29 JP9.1
PWM_3
  Top 0.254: STM.26 27.52,49.74 28.32,50.55 36.7,50.55 38.61,52.45 38.61,54.36 39.62,55.37 42.04,55.37 42.93,56.26 42.93,60.07 JP6.3
PWM_4
  Top 0.254: STM.61 10.86,42.23 7.62,45.47 7.62,50.16 JP10.1
PWM_5
  Top 0.254: STM.24 34.41,46.73 JP5.3
PWM_6
  Top 0.254: STM.62 10.6,41.73 7.62,44.7 JP12.1
PWM_7
  Top 0.254: STM.23 39.5,46.23 JP1.3
PWM_8
  Top 0.254: STM.63 9.48,41.23 4.45,36.2 JP13.1
PWM_9
  Top 0.254: STM.5 30.72,37.23 34.8,33.15 38.1,33.15 JP8.3
PWM_10
  Top 0.254: STM.64 9.74,40.73 6.35,37.34 6.35,29.34 JP14.1
PWM_11
  Top 0.254: STM.4 30.46,36.73 39.75,27.43 JP2.3
RGB_CH1
  Top 0.254: STM.67 10.52,39.23 7.87,36.58 7.87,23.71 R6.2
RGB_CH2
  Top 0.254: STM.68 10.79,38.73 8.38,36.32 8.38,26.42 10.29,24.51 R3.2
RGB_CH3
  Top 0.254: STM.69 11.05,38.23 8.89,36.07 8.89,26.67 10.79,24.77 12.06,24.77 12.32,24.51 R2.2
SDIO_CLK
  Top 0.254: SDCARD2.5 12.54,3.84 13.08,3.3 17.4,3.3 20.07,5.97 20.07,22.35 16.51,25.91 16.51,30.35 17.52,31.36 STM.80
SDIO_CMD  (via drill 0.61)
  Top 0.254: SDCARD2.3 14.74,4.56 v14.99,4.32 | STM.83 19.02,32.1 17.02,30.1 17.02,26.16 20.57,22.61 20.57,5.21 v19.69,4.32
  Bottom 0.254: v14.99,4.32 v19.69,4.32
SDIO_D0
  Top 0.254: STM.65 10,40.23 6.86,37.08 6.86,20.19 6.35,19.69 6.35,7.11 8.64,4.83 10.03,4.83 10.34,5.13 SDCARD2.7
SDIO_D1
  Top 0.254: STM.66 10.26,39.73 7.37,36.83 7.37,19.94 6.86,19.43 6.86,7.37 7.97,6.25 9.24,6.25 SDCARD2.8
SDIO_D2
  Top 0.254: SDCARD2.1 17.04,5.97 17.91,5.97 19.05,7.11 19.05,21.84 15.49,25.4 15.49,30.86 16.52,31.88 STM.78
SDIO_D3
  Top 0.254: SDCARD2.2 15.84,4.99 16.51,4.32 17.65,4.32 19.56,6.22 19.56,22.1 16,25.65 16,30.61 17.02,31.62 STM.79
SW-!RESET
  Top 0.254: STM.14 34.11,41.73 35.18,42.8 35.18,44.07 36.2,45.09 37.34,45.09 38.35,44.07 38.35,37.59 | 21.08,4.32 17.65,0.89 2.67,0.89 1.14,2.41 1.14,4.95 JP4.5 | S1.P$2 30.46,3.56 29.69,4.32 21.08,4.32 | 38.35,37.59 38.35,34.67 37.97,34.29 C13.1 | 38.35,37.59 42.04,37.59 42.93,36.7 42.93,21.72 42.16,20.96 22.23,20.96 21.08,19.81 21.08,4.32
SW_CLK  (via drill 0.61)
  Top 0.254: STM.76 15.52,31.6 14.99,31.07 14.99,25.15 18.54,21.59 18.54,11.68 15.87,9.02 10.79,9.02 9.4,10.41 v9.4,11.18
  Bottom 0.254: JP4.4 5.21,11.56 9.02,11.56 v9.4,11.18
SW_DIO  (via drill 0.61)
  Top 0.254: v9.4,12.7 10.16,12.7 13.21,15.75 13.21,24.64 12.57,25.27 11.05,25.27 9.4,26.92 9.4,35.81 10.31,36.73 STM.72
  Bottom 0.254: v9.4,12.7 5.08,12.7 JP4.3
USART1_RX
  Top 0.254: STM.93 24.02,28.18 U$10.2
USART1_TX
  Top 0.254: STM.92 23.52,30.02 U$10.3
USART3_RX
  Top 0.254: STM.56 11.41,44.73 9.65,46.48 9.65,60.71 11.3,62.36 16.64,62.36 17.53,63.25 U1.1
USART3_TX
  Top 0.254: STM.55 11.67,45.23 10.16,46.74 10.16,60.45 11.56,61.85 17.65,61.85 19.03,63.22 U1.2
VCC  (via drill 0.61)
  Top 0.508: R24.2 29.46,57.02 31.12,55.37 35.69,55.37 38.86,58.55 38.86,71.25 39.75,72.14 42.54,72.14 44.32,70.36 44.32,12.19 JP15.2
  Bottom 0.762: v31.12,5.97 31.12,6.99 40.51,6.99 41.27,7.75 JP15.2
  other vias: 26.8,16.51 25.15,16.51 25.53,5.97 26.92,5.97 26.92,7.37 25.53,7.37 28.32,5.97 29.72,5.97 29.72,7.37 28.32,7.37 31.24,19.56 29.59,19.56 31.24,18.03 28.45,17.02 26.8,14.86 25.15,14.86 28.45,14.86 29.59,15.75 30.61,16.76 29.59,18.03
  pour Top (isolate 0.762, no thermals): 31.75,20.07 31.75,5.33 24.77,5.33 24.77,20.07
  pour Bottom (isolate 0.762, no thermals): 31.62,19.94 31.62,17.14 28.96,14.48 22.1,14.48 21.34,15.24 21.34,16.51 24.38,16.51 24.77,16.89 27.69,16.89 29.21,18.42 29.21,19.94
  pour Bottom (isolate 0.762, no thermals): 31.62,8 31.62,5.46 25.02,5.46 23.75,6.73 21.59,6.73 21.59,8

### Text on the board
Top: SENSE1.0
tNames: 0 | 1 | 2 | 3 | 4 | 5 | 6 | 7 | 8 | 9 | 10 | 11 | 0V | 5V | DI | CL | RS | JUMP